# Altium project Muhtas_3.PrjPcb
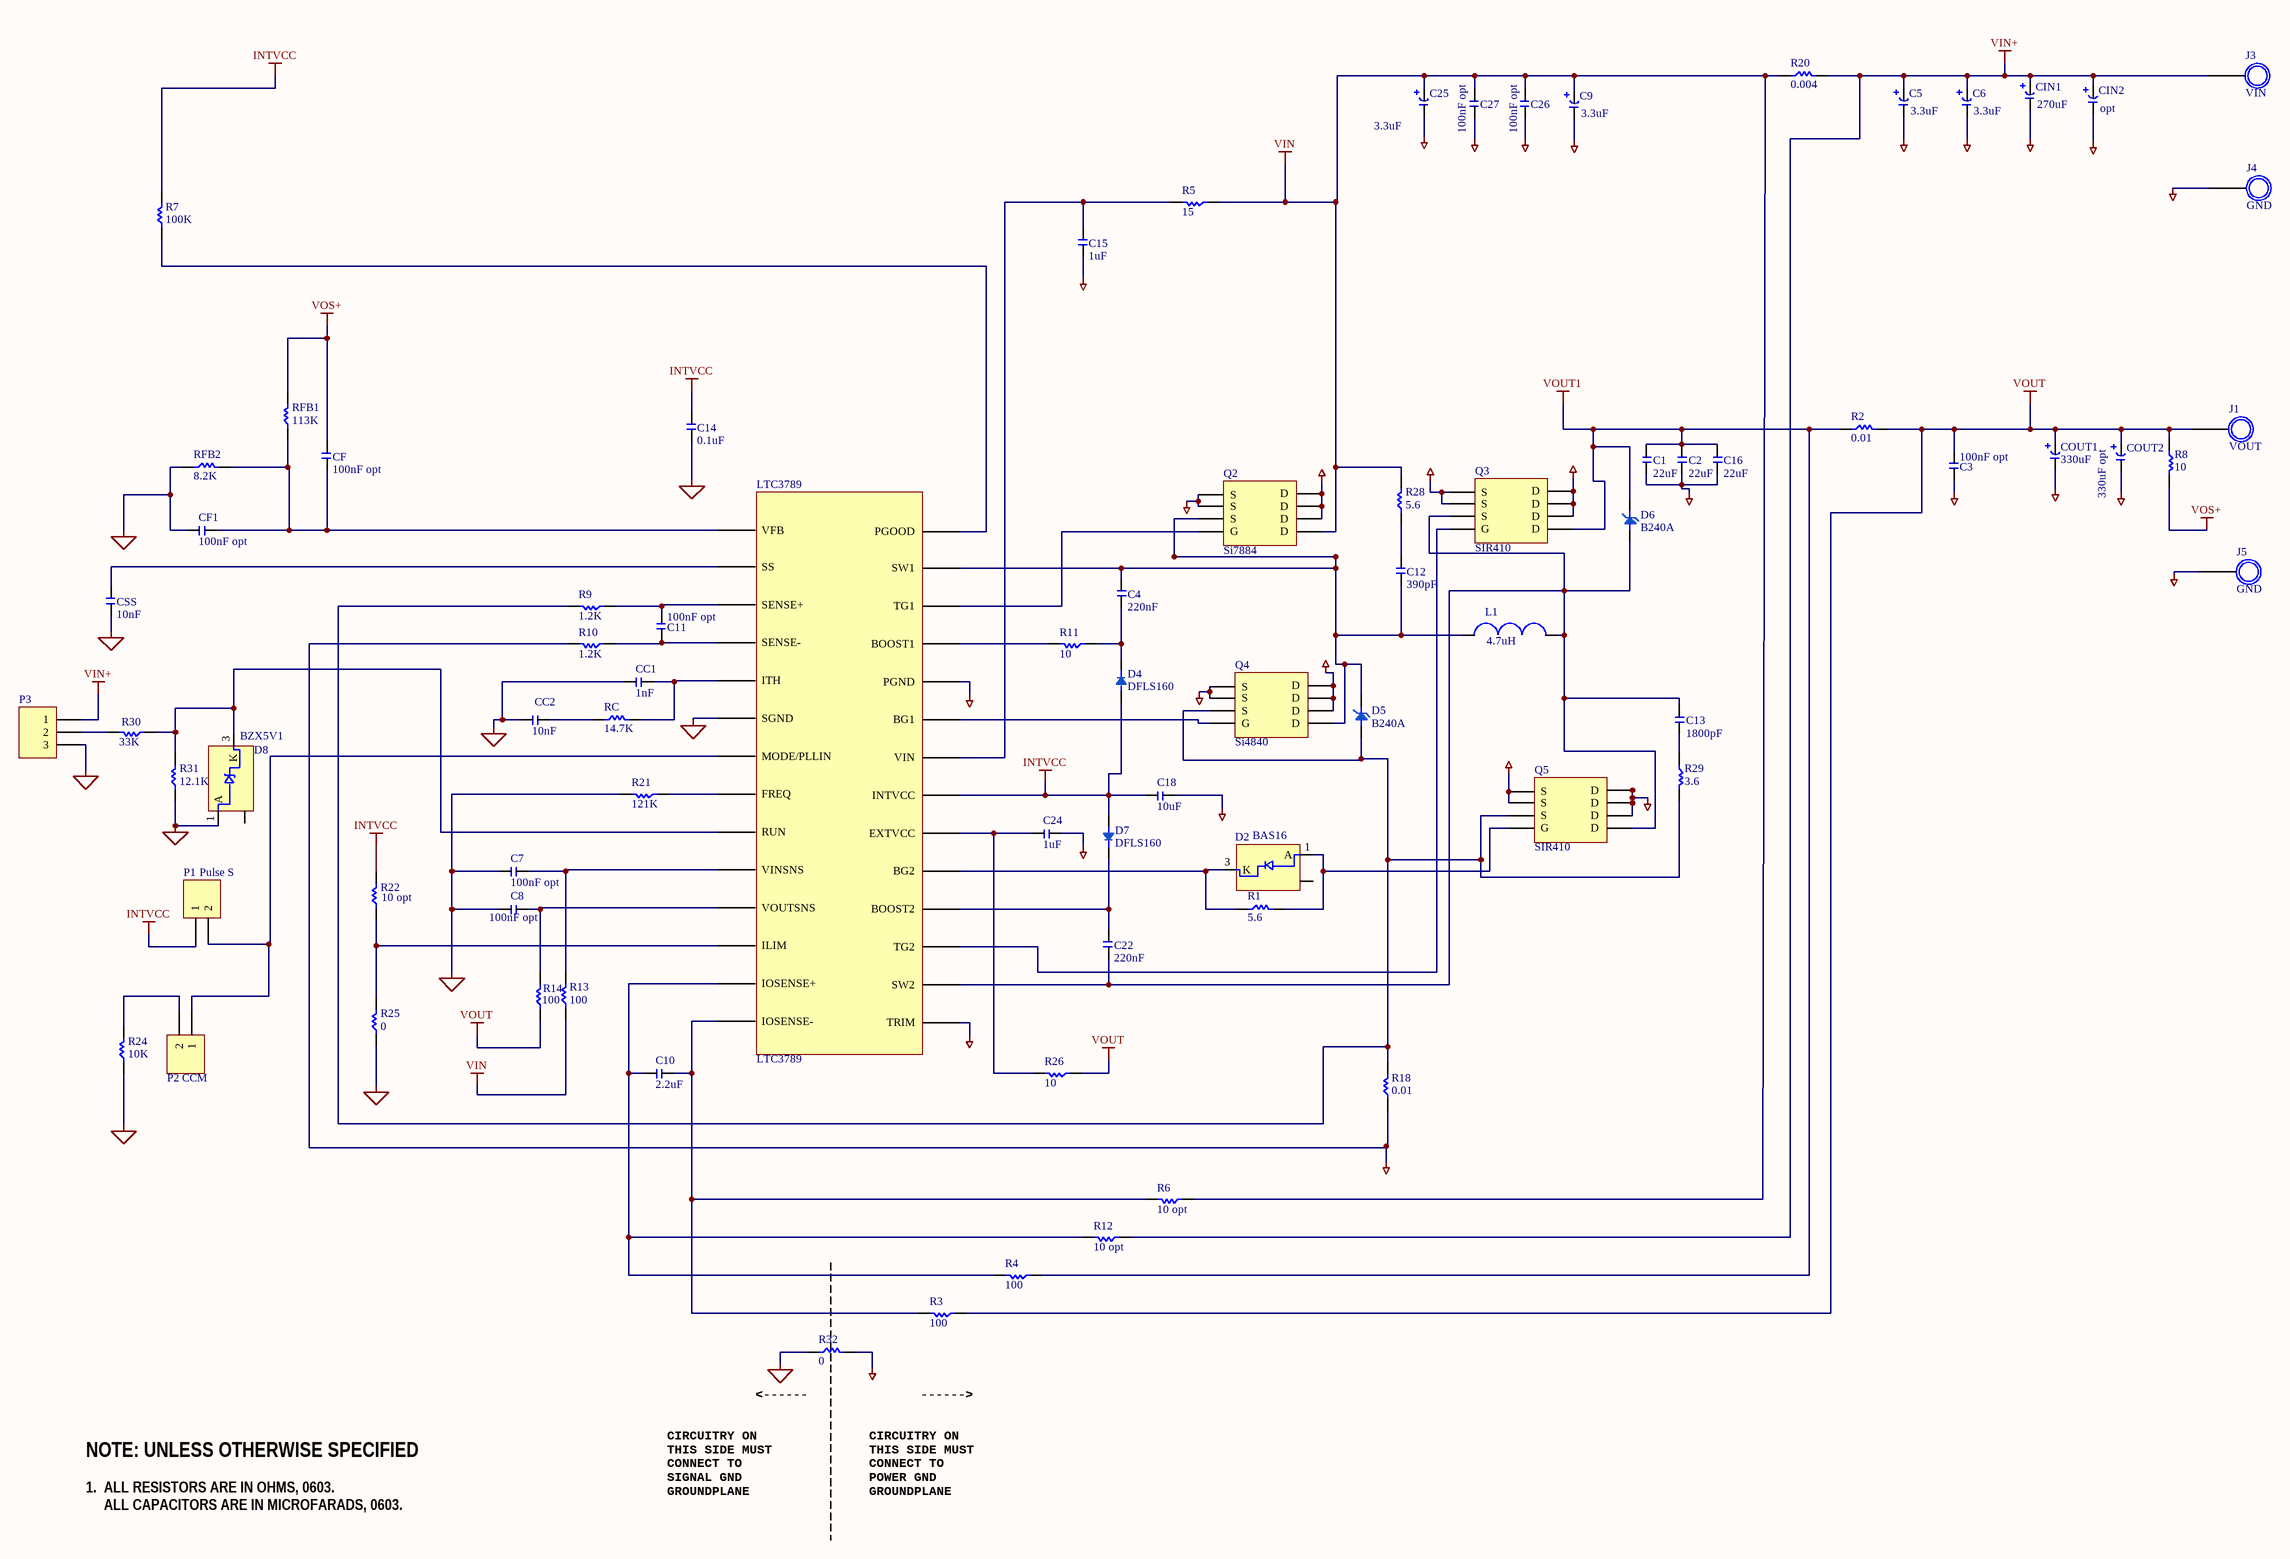
[diagram p0: muhtas3.SchDoc]
1 sheet, 79 parts. Net scope: global (net labels, ports and power ports of the same name join across sheets).
Board files: PCB4.PcbDoc, M_Tas3.PcbDoc

## Sheet muhtas3.SchDoc
size A2

### Parts
C1  22uF  [CAPC3216X190N(1206)]
C2  22uF  [CAPC3216X190N(1206)]
C3  100nF opt  [CAPC3216X190N(1206)]
C4  220nF  [CAPC2012X14N(0805)]
C5  3.3uF  [RAD5X10X16]
C6  3.3uF  [RAD5X10X16]
C7  100nF opt  [CAPC3216X190N(1206)]
C8  100nF opt  [CAPC3216X190N(1206)]
C9  3.3uF  [RAD5X10X16]
C10  2.2uF  [CAPC3216X190N(1206)]
C11  100nF opt  [CAPC3216X190N(1206)]
C12  390pF  [2.54X5.5MM]
C13  1800pF  [CAPC3216X190N(1206)]
C14  0.1uF  [CAPC3216X190N(1206)]
C15  1uF  [CAPC3216X190N(1206)]
C16  22uF  [CAPC3216X190N(1206)]
C18  10uF  [CAPC2012X14N(0805)]
C22  220nF  [CAPC2012X14N(0805)]
C24  1uF  [CAPC2012X14N(0805)]
C25  3.3uF  [RAD5X10X16]
C26  100nF opt  [CAPC3216X190N(1206)]
C27  100nF opt  [CAPC3216X190N(1206)]
CC1  1nF  [CAPC3216X190N(1206)]
CC2  10nF  [CAPC3216X190N(1206)]
CF  100nF opt  [CAPC3216X190N(1206)]
CF1  100nF opt  [CAPC3216X190N(1206)]
CIN1  270uF  [RAD5X10X16]
CIN2  opt  [RAD5X10X16]
COUT1  330uF  [OSCON]
COUT2  330uF opt  [OSCON]
CSS  10nF  [CAPC3216X190N(1206)]
D2  BAS16  [BZX5V1/SOT23]
D4  DFLS160  [DFLS160]
D5  B240A  [B240A]
D6  B240A  [B240A]
D7  DFLS160  [DFLS160]
D8  BZX5V1  [BZX5V1/SOT23]
J1  VOUT  [I/O]
J3  VIN  [I/O]
J4  GND  [I/O]
J5  GND  [I/O]
L1  4.7uH  [4.7UH]
LTC3789  LTC3789  [LTC3789]
P1  Header 2  [HDR1X2]  (value not drawn)
P2  Header 2  [HDR1X2]  (value not drawn)
P3  Header 3  [HDR1X3]  (value not drawn)
Q2  Si7884  [MOSFET]
Q3  SIR410  [MOSFET]
Q4  Si4840  [SOIC-8-SI4840]
Q5  SIR410  [MOSFET]
R1  5.6  [RESC2013X70N(0805)]
R2  0.01  [SUSUMU]
R3  100  [RESC3216X84N(1206)]
R4  100  [RESC3216X84N(1206)]
R5  15  [RESC3216X84N(1206)]
R6  10 opt  [RESC3216X84N(1206)]
R7  100K  [RESC3216X84N(1206)]
R8  10  [RESC3216X84N(1206)]
R9  1.2K  [AXIAL0.4]
R10  1.2K  [AXIAL0.4]
R11  10  [RESC3216X84N(1206)]
R12  10 opt  [RESC3216X84N(1206)]
R13  100  [RESC3216X84N(1206)]
R14  100  [RESC3216X84N(1206)]
R18  0.01  [SUSUMU]
R20  0.004  [SUSUMU]
R21  121K  [AXIAL0.4]
R22  10 opt  [RESC3216X84N(1206)]
R24  10K  [RESC3216X84N(1206)]
R25  0  [RESC2013X70N(0805)]
R26  10  [RESC3216X84N(1206)]
R28  5.6  [RESC2013X70N(0805)]
R29  3.6  [RESC3216X84N(1206)]
R30  33K  [RESC3216X84N(1206)]
R31  12.1K  [RESC2013X70N(0805)]
R32  0  [RESC2013X70N(0805)]
RC  14.7K  [RESC2013X70N(0805)]
RFB1  113K  [AXIAL0.4]
RFB2  8.2K  [RESC2013X70N(0805)]

### Nets
GND: C1.1 C2.1 C3.2 C5.2(K) C6.2(K) C9.2(K) C15.2 C16.1 C18.2 C24.2 C25.2(K) C26.2 C27.2 CIN1.2(K) CIN2.2(K) COUT1.2(K) COUT2.2(K) J4.1 J5.1 LTC3789.15(TRIM) LTC3789.24(PGND) Q2.1(S) Q2.2(S) Q2.6(D) Q2.7(D) Q2.8(D) Q3.1(S) Q3.2(S) Q3.6(D) Q3.7(D) Q3.8(D) Q4.1(S) Q4.2(S) Q4.6(D) Q4.7(D) Q4.8(D) Q5.1(S) Q5.2(S) Q5.6(D) Q5.7(D) Q5.8(D) R10.1 R18.2 R32.1
GND_SIGNAL: C7.1 C8.1 C14.2 CC1.1 CC2.1 CF1.1 CSS.2 D8.1(A) LTC3789.6(SGND) P3.3 R21.1 R24.2 R25.2 R31.2 R32.2 RFB2.2
INTVCC: C14.1 C18.1 D4.2(A) D7.2(A) LTC3789.21(INTVCC) P1.1 R7.1 R22.1
VIN: C9.1(A) C25.1(A) C26.1 C27.1 Q2.5(D) R5.2 R6.2 R13.2 R20.2 R28.1
VIN+: C5.1(A) C6.1(A) CIN1.1(A) CIN2.1(A) J3.1 P3.1 R12.2 R20.1
VOS+: CF.1 R8.1 RFB1.1
VOUT: C3.1 COUT1.1(A) COUT2.1(A) J1.1 R2.1 R3.2 R8.2 R14.2 R26.2
VOUT1: C1.2 C2.2 C16.2 D6.1(K) Q3.5(D) R2.2 R4.2
NetC4_1: C4.1 D4.1(K) R11.2
NetC4_2: C4.2 C12.2 D5.1(K) L1.1 LTC3789.27(SW1) Q2.3(S) Q4.5(D)
NetC7_2: C7.2 LTC3789.10(VINSNS) R13.1
NetC8_2: C8.2 LTC3789.11(VOUTSNS) R14.1
NetC10_1: C10.1 LTC3789.13(IOSENSE+) R4.1 R12.1
NetC10_2: C10.2 LTC3789.14(IOSENSE-) R3.1 R6.1
NetC11_1: C11.1 LTC3789.3(SENSE+) R9.2
NetC11_2: C11.2 LTC3789.4(SENSE-) R10.2
NetC12_1: C12.1 R28.2
NetC13_1: C13.1 R29.2
NetC13_2: C13.2 C22.2 D6.2(A) L1.2 LTC3789.16(SW2) Q3.3(S) Q5.5(D)
NetC15_1: C15.1 LTC3789.22(VIN) R5.1
NetC22_1: C22.1 D7.1(K) LTC3789.18(BOOST2)
NetC24_1: C24.1 LTC3789.20(EXTVCC) R26.1
NetCC1_2: CC1.2 LTC3789.5(ITH) RC.1
NetCC2_2: CC2.2 RC.2
NetCF_2: CF.2 CF1.2 LTC3789.1(VFB) RFB1.2 RFB2.1
NetCSS_1: CSS.1 LTC3789.2(SS)
NetD2_1: D2.1(A) Q5.4(G) R1.1
NetD2_3: D2.3(K) LTC3789.19(BG2) R1.2
NetD5_2: D5.2(A) Q4.3(S) Q5.3(S) R9.1 R18.1 R29.1
NetD8_3: D8.3(K) LTC3789.9(RUN) R30.2 R31.1
NetLTC3789_7: LTC3789.7(MODE/PLLIN) P1.2 P2.1
NetLTC3789_8: LTC3789.8(FREQ) R21.2
NetLTC3789_12: LTC3789.12(ILIM) R22.2 R25.1
NetLTC3789_17: LTC3789.17(TG2) Q3.4(G)
NetLTC3789_23: LTC3789.23(BG1) Q4.4(G)
NetLTC3789_25: LTC3789.25(BOOST1) R11.1
NetLTC3789_26: LTC3789.26(TG1) Q2.4(G)
NetLTC3789_28: LTC3789.28(PGOOD) R7.2
NetP2_2: P2.2 R24.1
NetP3_2: P3.2 R30.1

Not connected (* = marked no-connect by the designer): D2 2(not_connected); D8 2(not_connected)

### Notes on the sheet
- Pulse S
- CCM
- (near R32) <------               ------>
- 1.  ALL RESISTORS ARE IN OHMS, 0603.
  ALL CAPACITORS ARE IN MICROFARADS, 0603.
- NOTE: UNLESS OTHERWISE SPECIFIED
- CIRCUITRY ON
  THIS SIDE MUST
  CONNECT TO
  SIGNAL GND
  GROUNDPLANE
- CIRCUITRY ON
  THIS SIDE MUST
  CONNECT TO
  POWER GND
  GROUNDPLANE
- Title
- Size:
- Date:
- File:
- A2
- Number:
- Time:
- Revision:
- Sheet
- of

### Library data of the parts
C1-C3 C7 C8 C10 C11 C13-C16 C26 C27 CC1 CC2 CF CF1 CSS = VJ1206G475KXQTW1BC: CAPACITOR CERAMIC, 4.7UF, 10V, X5R, 10%, 1206, FULL REEL; Product Range:VJ?W1BC Series; Capacitance:4.7 F; Capacitance Tolerance: 10%; Dielectric Characteristic:X5R; Voltage Rating:10V; Ceramic Capacitor Case:1206 [3216 Metric] ;RoHS Compliant: Yes; Manufacturer: Vishay Vitramon; Component: 43; Dielectric Material: Tantalum; Manufacturer Part Number: VJ1206G475KXQTW1BC; Supplier 1: Mouser; Supplier Part Number 1: 77-VJ1206G475KXQTBC; RoHS: Yes; Category: Ceramic Capacitors; Stock 1: 1681; Pricing 1: 1=0,44000, 50=0,37200, 100=0,30800, 500=0,29900, 1000=0,29900, 2000=0,26000 (USD); Mount: Surface Mount; Case/Package: 1206; Min Operating Temperature: -55°C; Max Operating Temperature: 85°C; Capacitance: 4.7uF; Tolerance: 10%; Voltage Rating (DC): 10V; Dielectric: X5R; Length: 3.2mm; Height: 1.9mm; Depth: 1.6mm; ComponentLink1URL: https://datasheet.ciiva.com/11487/vjw1bcbascomseries-11487630.pdf?src-supplier=Avnet; ComponentLink1Description: https://datasheet.ciiva.com/11487/vjw1bcbascomseries-11487630.pdf?src-supplier=Avnet; Number of Pins: 2; Case Code (Metric): 3216; Case Code (Imperial): 1206; Packaging: Tape and Reel; Package Quantity: 2000; Termination: SMD/SMT; Width: 1.6mm; Lead Free: Lead Free
C4 C18 C22 C24 = CAP CER 100NF: TDK - CGA3E2X7R1H104K080AA. - CERAMIC CAPACITOR, 0.1UF, 50V, X7R, 0603, FULL REEL; Component: 8; Value: 100nF; Tolerance: 10%; Manufacturer Part Number: CAP CER 100NF; Supplier 1: Mouser; Supplier Part Number 1: 810-CGA3E2X7R1H104K; Manufacturer: TDK; RoHS: Yes; Category: Ceramic Capacitors; Stock 1: 5553529; Pricing 1: 1=0,11000, 10=0,07900, 100=0,03500, 500=0,02500, 1000=0,01900, 4000=0,01300 (USD); Mount: Surface Mount; Case/Package: 0603; Min Operating Temperature: -55°C; Max Operating Temperature: 125°C; Capacitance: 100nF; Voltage Rating (DC): 50V; Dielectric: X7R; Length: 1.6mm; Height: 0.8mm; Depth: 0.8mm; ComponentLink1URL: https://datasheet.ciiva.com/24216/cga3e2x7r1h104k080aa-266291-24216208.pdf?src-supplier=Mouser; ComponentLink1Description: https://datasheet.ciiva.com/24216/cga3e2x7r1h104k080aa-266291-24216208.pdf?src-supplier=Mouser; ComponentLink2URL: https://datasheet.ciiva.com/15192/getdatasheetpartid-715867-15192412.pdf?src-supplier=Verical; ComponentLink2Description: https://datasheet.ciiva.com/15192/getdatasheetpartid-715867-15192412.pdf?src-supplier=Verical; ComponentLink3URL: https://datasheet.ciiva.com/16500/mlccspec-automotive-general-midvoltage-en-16500693.pdf?src-supplier=Future+Electronics; ComponentLink3Description: https://datasheet.ciiva.com/16500/mlccspec-automotive-general-midvoltage-en-16500693.pdf?src-supplier=Future+Electronics; ComponentLink4URL: https://datasheet.ciiva.com/22725/1735392-22725642.pdf?src-supplier=Element14; ComponentLink4Description: https://datasheet.ciiva.com/22725/1735392-22725642.pdf?src-supplier=Element14; Case Code (Metric): 1608; Case Code (Imperial): 0603; Packaging: Tape and Reel; Voltage Rating: 50V; Package Quantity: 1; Termination: SMD/SMT; Voltage: 50V; Width: 0.8mm; Thickness: 0.035inch; Radiation Hardening: No; REACH SVHC: No SVHC; Lead Free: Lead Free; ComponentLink5URL: https://datasheet.ciiva.com/23803/1936565-23803084.pdf?src-supplier=Newark; ComponentLink5Description: https://datasheet.ciiva.com/23803/1936565-23803084.pdf?src-supplier=Newark; ComponentLink6URL: https://datasheet.ciiva.com/46385/1735392-46385708.pdf?src-supplier=Element14; ComponentLink6Description: https://datasheet.ciiva.com/46385/1735392-46385708.pdf?src-supplier=Element14; ComponentLink7URL: http://www.mouser.com/ds/2/212/KEM_C1012_X7R_OPENMODE_SMD-1103265.pdf?src-supplier=Mouser; ComponentLink7Description: http://www.mouser.com/ds/2/212/KEM_C1012_X7R_OPENMODE_SMD-1103265.pdf?src-supplier=Mouser; ComponentLink8URL: https://search.kemet.com/component-edge/download/datasheet/C0805F104K4RACTU.pdf?src-supplier=Digi-Key; Weight: 7.1E-05oz; Composition: Ceramic; Ratings: AEC-Q200; Features: Soft Termination
C5 C6 C9 C25 CIN1 CIN2 = CAP EL 470UF: ALUMINUM ELECTROLYTIC CAPACITOR 100UF, 63V, 20%, RADIAL, FULL REEL; Product Range:VR Series; Capacitance:100 F; Capacitance Tolerance: 20%; Voltage Rating:63V; Diameter:10mm; Capacitor Terminals:Radial Leaded; Packaging:Tape & Reel ;RoHS Compliant: Yes; Manufacturer: Nichicon; Component: 18; Dissipation Factor: 0.1%; Life (Hours): 2000Hour; Ripple Current: 300mA; Leakage Current: 189uA; Lead Diameter: 0.6mm; Manufacturer Part Number: CAP EL 470UF; Supplier 1: Arrow; Supplier Part Number 1: UVR1J101MPD1TD; RoHS: Yes; Category: Aluminum Electrolytic Capacitors; Stock 1: 105; Pricing 1: 1=0,21830, 10=0,14660, 25=0,05930, 100=0,05410, 2000=0,07080, 6000=0,06440 (USD); Mount: Through Hole,PCB; Case/Package: Radial; Min Operating Temperature: -40°C; Max Operating Temperature: 85°C; Capacitance: 100uF; Tolerance: 20%; Voltage Rating (DC): 63V; Length: 12.5mm; Height: 12.5mm; ComponentLink1URL: https://datasheet.ciiva.com/11685/e-vr-11685845.pdf?src-supplier=Avnet; ComponentLink1Description: https://datasheet.ciiva.com/11685/e-vr-11685845.pdf?src-supplier=Avnet; ComponentLink2URL: https://datasheet.ciiva.com/103/e-vr-103352.pdf?src-supplier=Digi-Key; ComponentLink2Description: https://datasheet.ciiva.com/103/e-vr-103352.pdf?src-supplier=Digi-Key; ComponentLink3URL: https://datasheet.ciiva.com/14603/70187464-14603353.pdf?src-supplier=Allied+Electronics; ComponentLink3Description: https://datasheet.ciiva.com/14603/70187464-14603353.pdf?src-supplier=Allied+Electronics; ComponentLink4URL: https://datasheet.ciiva.com/16392/e-vr-16392921.pdf?src-supplier=Future+Electronics; ComponentLink4Description: https://datasheet.ciiva.com/16392/e-vr-16392921.pdf?src-supplier=Future+Electronics; Number of Pins: 2; Packaging: Tape and Reel; Voltage Rating: 63V; Package Quantity: 500; Termination: Radial; Voltage: 63V; Diameter: 10mm; Height - Seated (Max): 0.492inch; Lead Pitch: 5mm; Radiation Hardening: No; REACH SVHC: No SVHC; ComponentLink5URL: https://datasheet.ciiva.com/46381/1758668-46381770.pdf?src-supplier=Element14; ComponentLink5Description: https://datasheet.ciiva.com/46381/1758668-46381770.pdf?src-supplier=Element14; ComponentLink6URL: https://datasheet.ciiva.com/17354/e-vr-17354940.pdf?src-supplier=Avnet+Europe; ComponentLink6Description: https://datasheet.ciiva.com/17354/e-vr-17354940.pdf?src-supplier=Avnet+Europe; ComponentLink7URL: https://datasheet.ciiva.com/7907/e-vr-7907502.pdf?src-supplier=Element14; ComponentLink7Description: https://datasheet.ciiva.com/7907/e-vr-7907502.pdf?src-supplier=Element14
C12 = CAP CER DISC 220PF: KEMET 220pF Multilayer Ceramic Capacitor (MLCC) 500 V dc 10% X7R dielectric C SMT max op. temp. +125C; Component: 2; Voltage Rating (DC): 500V; Dissipation Factor: 2.5%; Manufacturer Part Number: CAP CER DISC 220PF; Value: 220pF; Supplier 1: Mouser; Supplier Part Number 1: 80-C0805C221KCR; Manufacturer: KEMET; RoHS: Yes; Category: Ceramic Capacitors; Stock 1: 17842; Pricing 1: 1=0,37000, 10=0,21600, 100=0,15700, 500=0,13900, 1000=0,11800, 2500=0,09500 (USD); Mount: Surface Mount,PCB; Case/Package: 0805; Dielectric Material: Ceramic; Min Operating Temperature: -55°C; Max Operating Temperature: 125°C; Capacitance: 220pF; Tolerance: 10%; Dielectric: X7R; Length: 2mm; Height: 1.25mm; Depth: 1.2mm; ComponentLink1URL: https://datasheet.ciiva.com/14606/70096142-14606492.pdf?src-supplier=Allied+Electronics; ComponentLink1Description: https://datasheet.ciiva.com/14606/70096142-14606492.pdf?src-supplier=Allied+Electronics; Number of Pins: 2; Case Code (Metric): 2012; Case Code (Imperial): 0805; Packaging: Tape and Reel; Voltage Rating: 500V; Package Quantity: 1; Termination: SMD/SMT; Voltage: 500V; Width: 0.049inch; Thickness: 0.055inch
COUT1 COUT2 = 16SEPC180MX: CAP ALUM POLY 180UF 20% 16V T/H; Manufacturer: Panasonic; Component: 58; Dissipation Factor: 10%; Life (Hours): 5000Hour; Ripple Current: 5A; Leakage Current: 576uA; Polarity: Polar; ESR (Equivalent Series Resistance): 10mR; Lead Diameter: 0.6mm; Manufacturer Part Number: 16SEPC180MX; Supplier 1: Digi-Key; Supplier Part Number 1: P16295-ND; RoHS: Yes; Category: Polymer Capacitors; Stock 1: 64; Pricing 1: 1=1,03000, 10=0,78500, 50=0,65180, 100=0,56130, 500=0,43452, 1000=0,37417, 2500=0,35003, 5000=0,33193 (USD); Mount: Through Hole; Case/Package: Radial; Min Operating Temperature: -55°C; Max Operating Temperature: 105°C; Capacitance: 180uF; Tolerance: 20%; Voltage Rating (DC): 16V; Length: 9mm; Height: 9mm; ComponentLink1URL: https://datasheet.ciiva.com/25746/1734355-25746218.pdf?src-supplier=Farnell; ComponentLink1Description: https://datasheet.ciiva.com/25746/1734355-25746218.pdf?src-supplier=Farnell; ComponentLink2URL: https://datasheet.ciiva.com/24068/sepc-os-262388-24068492.pdf?src-supplier=Mouser; ComponentLink2Description: https://datasheet.ciiva.com/24068/sepc-os-262388-24068492.pdf?src-supplier=Mouser; ComponentLink3URL: https://datasheet.ciiva.com/22746/1734355-22746349.pdf?src-supplier=Element14; ComponentLink3Description: https://datasheet.ciiva.com/22746/1734355-22746349.pdf?src-supplier=Element14; Number of Pins: 9; Packaging: Bulk; Voltage Rating: 16V; Package Quantity: 200; Termination: Radial; Voltage: 16V; Diameter: 8mm; Height - Seated (Max): 0.354inch; Lead Pitch: 3.5mm; REACH SVHC: No SVHC
D2 = SIR410DP-T1-GE3: MOSFET 20V 35A 36W; Manufacturer: Vishay Siliconix; Component: 8; Number of Contacts: 0; Element Configuration: Single; Power Dissipation: 4.2W; Rds On Max: 4.8mR; Input Capacitance: 1.6nF; Rise Time: 15ns; Drain to Source Resistance: 5mR; Turn-Off Delay Time: 30ns; Turn-On Delay Time: 25ns; Threshold Voltage: 1.2V; Number of Channels: 1; Manufacturer Part Number: SIR410DP-T1-GE3; Supplier 1: Digi-Key; Supplier Part Number 1: SIR410DP-T1-GE3CT-ND; RoHS: Yes; Category: MOSFETs; Stock 1: 7964; Pricing 1: 1=1,02000, 10=0,91500, 25=0,86800, 100=0,65100, 500=0,55180, 1000=0,44950 (USD); Mount: Surface Mount; Number of Pins: 8; Weight: 0.01787oz; Min Operating Temperature: -55°C; Max Operating Temperature: 150°C; Packaging: Tape and Reel; Max Power Dissipation: 36W; Package Quantity: 1; Length: 4.9mm; Height: 1.04mm; Width: 5.89mm; Radiation Hardening: No; Lead Free: Lead Free; REACH SVHC: Unknown; ComponentLink1URL: https://datasheet.ciiva.com/6376/sir410d-6376914.pdf?src-supplier=Digi-Key; ComponentLink1Description: https://datasheet.ciiva.com/6376/sir410d-6376914.pdf?src-supplier=Digi-Key; ComponentLink2URL: https://datasheet.ciiva.com/4438/sir410d-280000-4438492.pdf?src-supplier=Mouser; ComponentLink2Description: https://datasheet.ciiva.com/4438/sir410d-280000-4438492.pdf?src-supplier=Mouser; Number of Rows: 0; Number of Positions: 0; Number of Elements: 0; Number of Unidirectional Channels: 0; Drain to Source Voltage (Vdss): 20V; Continuous Drain Current (ID): 35A; Drain to Source Breakdown Voltage: 20V; Gate to Source Voltage (Vgs): 20V; Fall Time: 15ns
D4 D7 = DFLS160Q-7: DIODE SCHOTTKY 60V 1A POWERDI123; Manufacturer: Diodes; Component: 11; Number of Contacts: 0; Element Configuration: Single; Forward Voltage: 500mV; Average Rectified Current: 01:00:00; Max Forward Surge Current (Ifsm): 50A; Max Reverse Current: 100uA; Manufacturer Part Number: DFLS160Q-7; Supplier 1: Digi-Key; Supplier Part Number 1: DFLS160Q-7DICT-ND; RoHS: Yes; Category: Rectifier Diodes; Stock 1: 17360; Pricing 1: 1=0,66000, 10=0,58300, 100=0,39770, 500=0,33230, 1000=0,28280 (USD); Mount: Surface Mount; Number of Pins: 123; Min Operating Temperature: -65°C; Max Operating Temperature: 150°C; Packaging: Tape and Reel; Package Quantity: 3000; ComponentLink1URL: http://www.mouser.com/ds/2/115/DFLS160Q-335693.pdf?src-supplier=Mouser; ComponentLink1Description: http://www.mouser.com/ds/2/115/DFLS160Q-335693.pdf?src-supplier=Mouser; ComponentLink2URL: http://diodes.com/datasheets/DFLS160Q.pdf?src-supplier=Avnet; ComponentLink2Description: http://diodes.com/datasheets/DFLS160Q.pdf?src-supplier=Avnet; ComponentLink3URL: https://www.diodes.com/assets/Datasheets/DFLS160Q.pdf?src-supplier=Digi-Key; ComponentLink3Description: https://www.diodes.com/assets/Datasheets/DFLS160Q.pdf?src-supplier=Digi-Key; Number of Rows: 0; Number of Positions: 0; Number of Elements: 0; Number of Unidirectional Channels: 0; Max Repetitive Reverse Voltage (Vrrm): 60V; Max Reverse Voltage (DC): 60V; Forward Current: 01:00:00
D5 D6 = B240-13-F: DIODES INC. - B240-13-F - Schottky Rectifier, 40 V, 2 A, Single, DO-214AA (SMB), 2 Pins, 500 mV; Component: 12; Voltage Rating (DC): 40V; Capacitance: 200pF; Current Rating: 2A; Number of Contacts: 0; Peak Non-Repetitive Surge Current: 50A; Forward Voltage: 500mV; Average Rectified Current: 02:00:00; Polarity: Standard; Max Reverse Current: 500uA; Manufacturer Part Number: B240-13-F; Supplier 1: Digi-Key; Supplier Part Number 1: B240-FDICT-ND; Manufacturer: Diodes; RoHS: Yes; Category: Schottky Diodes; Stock 1: 76580; Pricing 1: 1=0,41000, 10=0,30800, 100=0,14650, 500=0,12978, 1000=0,10100 (USD); Mount: Surface Mount; Case/Package: SMB; Number of Pins: 2; Weight: 0.00328oz; Contact Plating: Tin,Matte; Min Operating Temperature: -65°C; Max Operating Temperature: 150°C; Packaging: Tape and Reel; Termination: SMD/SMT; Package Quantity: 3000; Length: 4.57mm; Height: 2.62mm; Width: 3.94mm; Radiation Hardening: No; Lead Free: Lead Free; REACH SVHC: No SVHC; ComponentLink1URL: https://datasheet.ciiva.com/913/ds13004-913158.pdf?src-supplier=Digi-Key; ComponentLink1Description: https://datasheet.ciiva.com/913/ds13004-913158.pdf?src-supplier=Digi-Key; ComponentLink2URL: https://datasheet.ciiva.com/16201/ds13004-16201032.pdf?src-supplier=Future+Electronics; ComponentLink2Description: https://datasheet.ciiva.com/16201/ds13004-16201032.pdf?src-supplier=Future+Electronics; ComponentLink3URL: https://datasheet.ciiva.com/15144/getdatasheetpartid-91432-15144684.pdf?src-supplier=Verical; ComponentLink3Description: https://datasheet.ciiva.com/15144/getdatasheetpartid-91432-15144684.pdf?src-supplier=Verical; Number of Rows: 0; Number of Positions: 0; Element Configuration: Single; Number of Elements: 0; Number of Unidirectional Channels: 0; Max Repetitive Reverse Voltage (Vrrm): 40V; Max Reverse Voltage (DC): 40V; Forward Current: 02:00:00; Max Forward Surge Current (Ifsm): 50A; Output Current: 02:00:00; Current: 2A; Voltage: 40V
D8 = BZX84B5V1LT1G: Diode Zener Single 5.1V 2% 300mW 3-Pin SOT-23 T/R; Manufacturer: ON Semiconductor; Component: 9; Max Power Dissipation: 225mW; Number of Contacts: 0; Max Reverse Leakage Current: 2uA; Test Current: 5mA; ESD Protection: Yes; Forward Voltage: 900mV; Impedance: 60R; Material: Plastic; Zener Current: 10mA; Manufacturer Part Number: BZX84B5V1LT1G; Supplier 1: Digi-Key; Supplier Part Number 1: BZX84B5V1LT1GOSCT-ND; RoHS: Yes; Category: Zener Diodes; Stock 1: 57037; Pricing 1: 1=0,17000, 10=0,14600, 100=0,05620, 500=0,04680, 1000=0,02750 (USD); Case/Package: SOT-23-3; Number of Pins: 3; Contact Plating: Tin,Matte; Min Operating Temperature: -65°C; Max Operating Temperature: 150°C; Tolerance: 2%; Packaging: Tape and Reel; Power Rating: 225mW; Package Quantity: 3000; Voltage Rating (DC): 5.1V; Length: 2.9mm; Height: 0.94mm; Width: 1.3mm; Radiation Hardening: No; Lead Free: Lead Free; REACH SVHC: No SVHC; ComponentLink1URL: https://datasheet.ciiva.com/15142/getdatasheetpartid-38799-15142007.pdf?src-supplier=Verical; ComponentLink1Description: https://datasheet.ciiva.com/15142/getdatasheetpartid-38799-15142007.pdf?src-supplier=Verical; ComponentLink2URL: https://datasheet.ciiva.com/894/bzx84c2v4lt1-d-894869.pdf?src-supplier=Digi-Key; ComponentLink2Description: https://datasheet.ciiva.com/894/bzx84c2v4lt1-d-894869.pdf?src-supplier=Digi-Key; ComponentLink3URL: https://datasheet.ciiva.com/16542/bzx84c2v4lt1-d-16542005.pdf?src-supplier=Avnet+Asia; ComponentLink3Description: https://datasheet.ciiva.com/16542/bzx84c2v4lt1-d-16542005.pdf?src-supplier=Avnet+Asia; ComponentLink4URL: https://datasheet.ciiva.com/894/bzx84c2v4lt1-d-894870.pdf?src-supplier=Digi-Key; ComponentLink4Description: https://datasheet.ciiva.com/894/bzx84c2v4lt1-d-894870.pdf?src-supplier=Digi-Key; ComponentLink5URL: https://datasheet.ciiva.com/10637/bzx84c2v4lt1-d-10637782.pdf?src-supplier=Avnet; ComponentLink5Description: https://datasheet.ciiva.com/10637/bzx84c2v4lt1-d-10637782.pdf?src-supplier=Avnet; ComponentLink6URL: https://datasheet.ciiva.com/894/bzx84c2v4lt1-d-894871.pdf?src-supplier=Digi-Key; ComponentLink6Description: https://datasheet.ciiva.com/894/bzx84c2v4lt1-d-894871.pdf?src-supplier=Digi-Key; ComponentLink7URL: https://datasheet.ciiva.com/16419/bzx84c2v4lt1-d-16419770.pdf?src-supplier=Future+Electronics; ComponentLink7Description: https://datasheet.ciiva.com/16419/bzx84c2v4lt1-d-16419770.pdf?src-supplier=Future+Electronics; ComponentLink8URL: https://datasheet.ciiva.com/26092/bzx84c2v4lt1-d-26092127.pdf?src-supplier=Avnet+Europe; ComponentLink8Description: https://datasheet.ciiva.com/26092/bzx84c2v4lt1-d-26092127.pdf?src-supplier=Avnet+Europe; Working Voltage: 5.1V; Voltage Tolerance: 2%; Number of Rows: 0; Number of Positions: 0; Element Configuration: Single; Number of Elements: 0; Number of Unidirectional Channels: 0; Power Dissipation: 300mW; Halogen Free: Halogen Free; Zener Voltage: 5.1V; Max Reverse Current: 2uA
J1 J3-J5 = 78B03ST: SWITCH SLIDE DIP SPST 150MA 30V; Manufacturer: Grayhill; Component: 4; Number of Contacts: 0; Body Material: Thermoplastic; Mechanical Life: 2000Cycles; Actuator Type: Slide (Standard); Manufacturer Part Number: 78B03ST; Supplier 1: Digi-Key; Supplier Part Number 1: GH7182-ND; RoHS: Yes; Category: DIP Switches; Stock 1: 495; Pricing 1: 1=1,27000, 10=1,22500, 25=1,15160, 100=0,99470, 250=0,90652, 500=0,84280, 1000=0,78400, 2500=0,71050, 5000=0,66150 (USD); Mount: Through Hole,PCB; Contact Plating: Gold; Min Operating Temperature: -40°C; Max Operating Temperature: 85°C; Packaging: Rail/Tube; Termination: PC Pins; Voltage Rating (DC): 30V; ComponentLink1URL: https://datasheet.ciiva.com/16405/dip-series-78-spst-4pst-16405784.pdf?src-supplier=Future+Electronics; ComponentLink1Description: https://datasheet.ciiva.com/16405/dip-series-78-spst-4pst-16405784.pdf?src-supplier=Future+Electronics; ComponentLink2URL: https://datasheet.ciiva.com/16198/63dip-series-78-spst-4pst-16198539.pdf?src-supplier=Onlinecomponents.com; ComponentLink2Description: https://datasheet.ciiva.com/16198/63dip-series-78-spst-4pst-16198539.pdf?src-supplier=Onlinecomponents.com; ComponentLink3URL: https://datasheet.ciiva.com/2865/series78dip-2865725.pdf?src-supplier=Digi-Key; ComponentLink3Description: https://datasheet.ciiva.com/2865/series78dip-2865725.pdf?src-supplier=Digi-Key; ComponentLink4URL: https://datasheet.ciiva.com/15219/getdatasheetpartid-174628-15219357.pdf?src-supplier=Verical; ComponentLink4Description: https://datasheet.ciiva.com/15219/getdatasheetpartid-174628-15219357.pdf?src-supplier=Verical; ComponentLink5URL: https://datasheet.ciiva.com/14543/70216689-14543118.pdf?src-supplier=Allied+Electronics; ComponentLink5Description: https://datasheet.ciiva.com/14543/70216689-14543118.pdf?src-supplier=Allied+Electronics; Max Voltage Rating (DC): 30V; Current Rating: 150mA; Number of Rows: 0; Orientation: Straight; Number of Positions: 0; Number of Elements: 0; Number of Unidirectional Channels: 0; Contact Material: Copper Alloy,Brass,Gold; Throw Configuration: SPST; Electrical Life: 2000Cycles
L1 = IHLP2525CZER4R7M01: Inductor Power Shielded Wirewound 4.7uH 20% 100KHz 5.5A 40mOhm DCR 2525 T/R; Manufacturer: Vishay Dale; alan: 3; Core Material: Metal,Composite,Ferrite; DC Resistance (DCR): 40mR; Max DC Current: 10A; Self Resonant Frequency: 5MHz; Manufacturer Part Number: IHLP2525CZER4R7M01; Supplier 1: Digi-Key; Supplier Part Number 1: 541-1010-1-ND; RoHS: Yes; Stock 1: 66868; Pricing 1: 1=1,10000, 10=1,01700, 25=0,93920, 50=0,78260, 100=0,73560, 250=0,65732, 500=0,56340, 1000=0,50080 (USD); Category: Fixed Inductors; Mount: Surface Mount; Case/Package: 2525; Number of Pins: 2; Case Code (Metric): 6363; Case Code (Imperial): 2525; Contact Plating: Tin,Matte; Min Operating Temperature: -55°C; Max Operating Temperature: 125°C; Inductance Tolerance: 20%; Inductance: 4.7uH; Tolerance: 20%; Packaging: Tape and Reel; Current Rating: 5.5A; Shielding: Shielded; Package Quantity: 2000; Test Frequency: 100kHz; Saturation Current: 10A; Termination: SMD/SMT; RMS Current (Irms): 5.5A; Length: 7.24mm; Width: 0.255inch; Height: 3mm; Height - Seated (Max): 0.118inch; Depth: 6.72mm; Radiation Hardening: No; REACH SVHC: Unknown; Military Standard: Not; Lead Free: Lead Free; ComponentLink1URL: https://datasheet.ciiva.com/5706/1671361-5706705.pdf?src-supplier=Farnell; ComponentLink1Description: https://datasheet.ciiva.com/5706/1671361-5706705.pdf?src-supplier=Farnell; ComponentLink2URL: https://datasheet.ciiva.com/11798/0900766b8102c934-11798179.pdf?src-supplier=RSComponents; ComponentLink2Description: https://datasheet.ciiva.com/11798/0900766b8102c934-11798179.pdf?src-supplier=RSComponents; ComponentLink3URL: https://datasheet.ciiva.com/26793/ihlp2525czer4r7m01-26793547.pdf?src-supplier=IIIC; ComponentLink3Description: https://datasheet.ciiva.com/26793/ihlp2525czer4r7m01-26793547.pdf?src-supplier=IIIC; ComponentLink4URL: https://datasheet.ciiva.com/17247/lp25cz01-17247205.pdf?src-supplier=Avnet+Europe; ComponentLink4Description: https://datasheet.ciiva.com/17247/lp25cz01-17247205.pdf?src-supplier=Avnet+Europe; ComponentLink5URL: https://datasheet.ciiva.com/16335/lp25cz01-16335799.pdf?src-supplier=Future+Electronics; ComponentLink5Description: https://datasheet.ciiva.com/16335/lp25cz01-16335799.pdf?src-supplier=Future+Electronics; ComponentLink6URL: https://datasheet.ciiva.com/7290/ihlp25cz-7290185.pdf?src-supplier=Newark; ComponentLink6Description: https://datasheet.ciiva.com/7290/ihlp25cz-7290185.pdf?src-supplier=Newark; ComponentLink7URL: https://datasheet.ciiva.com/8495/lp25cz01-8495083.pdf?src-supplier=Avnet; ComponentLink7Description: https://datasheet.ciiva.com/8495/lp25cz01-8495083.pdf?src-supplier=Avnet; ComponentLink8URL: https://datasheet.ciiva.com/16940/70201586-16940508.pdf?src-supplier=Allied+Electronics; ComponentLink8Description: https://datasheet.ciiva.com/16940/70201586-16940508.pdf?src-supplier=Allied+Electronics; ComponentLink9URL: https://datasheet.ciiva.com/26821/getdatasheetpartid-74581-26821228.pdf?src-supplier=Verical; ComponentLink9Description: https://datasheet.ciiva.com/26821/getdatasheetpartid-74581-26821228.pdf?src-supplier=Verical
LTC3789 = LTC3789EGN#PBF: DC DC Cntrlr Dual-OUT Synchronous Boost/Buck Controller 4V to 38V Input Automotive 28-Pin SSOP N; Manufacturer: Analog Devices / Linear Technology; Component: 26; Output Current: 20A; Number of Outputs: 1; Switching Frequency: 710kHz; Output Type: Adjustable; Duty Cycle: 98%; Manufacturer Part Number: LTC3789EGN#PBF; Supplier 1: Digi-Key; Supplier Part Number 1: LTC3789EGN#PBF-ND; RoHS: Yes; Category: Voltage Regulators - Switching; Stock 1: 809; Pricing 1: 1=11,59000, 25=7,69960, 100=6,36480, 250=6,04656, 500=5,90954 (USD); Case/Package: SSOP; Number of Pins: 28; Min Operating Temperature: -40°C; Max Operating Temperature: 125°C; Package Quantity: 49; Packaging: Rail/Tube; REACH SVHC: No SVHC; ComponentLink1URL: https://datasheet.ciiva.com/14151/ltc3789-eng-ds-14151002.pdf?src-supplier=Distrelec; ComponentLink1Description: https://datasheet.ciiva.com/14151/ltc3789-eng-ds-14151002.pdf?src-supplier=Distrelec; ComponentLink2URL: https://datasheet.ciiva.com/15267/53789fb-15267774.pdf?src-supplier=Arrow+Europe; ComponentLink2Description: https://datasheet.ciiva.com/15267/53789fb-15267774.pdf?src-supplier=Arrow+Europe; ComponentLink3URL: https://datasheet.ciiva.com/26893/ltc3789egn-pbf-26893678.pdf?src-supplier=IIIC; ComponentLink3Description: https://datasheet.ciiva.com/26893/ltc3789egn-pbf-26893678.pdf?src-supplier=IIIC; ComponentLink4URL: https://datasheet.ciiva.com/6192/1865679-6192839.pdf?src-supplier=Farnell; ComponentLink4Description: https://datasheet.ciiva.com/6192/1865679-6192839.pdf?src-supplier=Farnell; ComponentLink5URL: https://datasheet.ciiva.com/7906/1865679-7906007.pdf?src-supplier=Element14; ComponentLink5Description: https://datasheet.ciiva.com/7906/1865679-7906007.pdf?src-supplier=Element14; ComponentLink6URL: https://datasheet.ciiva.com/7906/1511849-7906151.pdf?src-supplier=Element14; ComponentLink6Description: https://datasheet.ciiva.com/7906/1511849-7906151.pdf?src-supplier=Element14; ComponentLink7URL: https://datasheet.ciiva.com/2015/30095-2015247.pdf?src-supplier=Digi-Key; ComponentLink7Description: https://datasheet.ciiva.com/2015/30095-2015247.pdf?src-supplier=Digi-Key; Min Supply Voltage: 4V; Max Supply Voltage: 38V; Output Voltage: 38V; Max Frequency: 710kHz
P1 P2 = Header 2: Header, 2-Pin; LatestRevisionDate: 17-Jul-2002; LatestRevisionNote: Re-released for DXP Platform.; Publisher: Altium Limited
P3 = Header 3: Header, 3-Pin; LatestRevisionDate: 17-Jul-2002; LatestRevisionNote: Re-released for DXP Platform.; Publisher: Altium Limited
Q2 Q3 Q5 = SIR410DP-T1-GE3: MOSFET 20V 35A 36W; Manufacturer: Vishay Siliconix; Component: 27; Number of Channels: 1; Turn-On Delay Time: 25ns; Power Dissipation: 4.2W; Rise Time: 15ns; Element Configuration: Single; Turn-Off Delay Time: 30ns; Rds On Max: 4.8mR; Input Capacitance: 1.6nF; Drain to Source Resistance: 5mR; Threshold Voltage: 1.2V; Manufacturer Part Number: SIR410DP-T1-GE3; Supplier 1: Digi-Key; Supplier Part Number 1: SIR410DP-T1-GE3CT-ND; RoHS: Yes; Category: MOSFETs; Stock 1: 7964; Pricing 1: 1=1,02000, 10=0,91500, 25=0,86800, 100=0,65100, 500=0,55180, 1000=0,44950 (USD); Number of Pins: 8; Min Operating Temperature: -55°C; Max Operating Temperature: 150°C; Package Quantity: 1; Packaging: Tape and Reel; REACH SVHC: Unknown; ComponentLink1URL: https://datasheet.ciiva.com/6376/sir410d-6376914.pdf?src-supplier=Digi-Key; ComponentLink1Description: https://datasheet.ciiva.com/6376/sir410d-6376914.pdf?src-supplier=Digi-Key; ComponentLink2URL: https://datasheet.ciiva.com/4438/sir410d-280000-4438492.pdf?src-supplier=Mouser; ComponentLink2Description: https://datasheet.ciiva.com/4438/sir410d-280000-4438492.pdf?src-supplier=Mouser; Mount: Surface Mount; Weight: 0.01787oz; Max Power Dissipation: 36W; Length: 4.9mm; Height: 1.04mm; Width: 5.89mm; Radiation Hardening: No; Lead Free: Lead Free; Number of Elements: 1; Fall Time: 15ns; Continuous Drain Current (ID): 35A; Gate to Source Voltage (Vgs): 20V; Drain to Source Voltage (Vdss): 20V; Drain to Source Breakdown Voltage: 20V
Q4 = SI4840DY-T1-E3: MOSFET N-CH 40V 10A 8-SOIC; Manufacturer: Vishay Siliconix; Component: 30; Number of Channels: 1; Max Power Dissipation: 1.56W; Turn-On Delay Time: 15ns; Rise Time: 10ns; Fall Time: 20ns; Element Configuration: Single; Gate to Source Voltage (Vgs): 20V; Turn-Off Delay Time: 50ns; Rds On Max: 9mR; Manufacturer Part Number: SI4840DY-T1-E3; Supplier 1: Newark; Supplier Part Number 1: 35K3476; RoHS: Yes; Category: MOSFETs; Case/Package: SO; Number of Pins: 8; Min Operating Temperature: -55°C; Max Operating Temperature: 150°C; Package Quantity: 2500; Packaging: Tape and Reel; ComponentLink1URL: https://datasheet.ciiva.com/945/71188-945204.pdf?src-supplier=Digi-Key; ComponentLink1Description: https://datasheet.ciiva.com/945/71188-945204.pdf?src-supplier=Digi-Key; ComponentLink2URL: https://datasheet.ciiva.com/17084/si4840dy-t1-e3-17084039.pdf?src-supplier=Allied+Electronics; ComponentLink2Description: https://datasheet.ciiva.com/17084/si4840dy-t1-e3-17084039.pdf?src-supplier=Allied+Electronics; ComponentLink3URL: https://datasheet.ciiva.com/26790/si4840dy-t1-e3-26790652.pdf?src-supplier=IIIC; ComponentLink3Description: https://datasheet.ciiva.com/26790/si4840dy-t1-e3-26790652.pdf?src-supplier=IIIC; ComponentLink4URL: https://datasheet.ciiva.com/945/71188-945206.pdf?src-supplier=Digi-Key; ComponentLink4Description: https://datasheet.ciiva.com/945/71188-945206.pdf?src-supplier=Digi-Key; Mount: Surface Mount; Weight: 0.006596oz; Voltage Rating (DC): 40V; Length: 5mm; Height: 1.55mm; Width: 4mm; Lead Free: Lead Free; ComponentLink5URL: https://datasheet.ciiva.com/18403/70026069-18403703.pdf?src-supplier=Allied+Electronics; ComponentLink5Description: https://datasheet.ciiva.com/18403/70026069-18403703.pdf?src-supplier=Allied+Electronics; Number of Elements: 1; Power Dissipation: 1.56W; Continuous Drain Current (ID): 10A; Drain to Source Voltage (Vdss): 40V; Drain to Source Breakdown Voltage: 40V; Drain to Source Resistance: 9mR
R1 R28 R31 = RC2012J473AS: Res Thick Film 0805 47K Ohm 5% 1/8W ±100ppm/°C Molded SMD T/R; Manufacturer: Samsung; Component: 15; Resistance: 47kR; Power Rating: 125mW; Voltage Rating (DC): 150V; Number of Contacts: 0; Manufacturer Part Number: RC2012J473AS; Supplier 1: Avnet; Supplier Part Number 1: RC2012J473AS; RoHS: Yes; Category: Chip SMD Resistors; Mount: Surface Mount; Case/Package: 0805; Contact Plating: Tin; Min Operating Temperature: -55°C; Max Operating Temperature: 155°C; Tolerance: 5%; Temperature Coefficient: 100ppm/°C; Composition: Thick Film; Lead Free: Lead Free; ComponentLink1URL: https://sem.samsung.co.kr/servlet/DownloadServletWS?dir=/kr/product/&num=&fileName=Resistor_General.pdf&src-supplier=Avnet; ComponentLink1Description: https://sem.samsung.co.kr/servlet/DownloadServletWS?dir=/kr/product/&num=&fileName=Resistor_General.pdf&src-supplier=Avnet; ComponentLink2URL: https://sem.samsung.co.kr/servlet/DownloadServletWS?dir=/kr/product/&num=&fileName=Resistor_General.pdf&src-supplier=Avnet+Europe; ComponentLink2Description: https://sem.samsung.co.kr/servlet/DownloadServletWS?dir=/kr/product/&num=&fileName=Resistor_General.pdf&src-supplier=Avnet+Europe; Number of Rows: 0; Number of Positions: 0; Number of Elements: 0; Number of Unidirectional Channels: 0
R2 R18 R20 = RL1220S-R50-F: SUSUMU         RL1220S-R50-F             SMD Current Sense Resistor, 0.5 ohm, 0805 [2012 Metric], 250 mW,  1%, RL Series; Component: 26; Resistance: 500mR; Temperature Coefficient: 200ppm/°C; Max Power Dissipation: 333mW; Power Rating: 250mW; Voltage Rating (DC): 100V; Number of Contacts: 0; Manufacturer Part Number: RL1220S-R50-F; Supplier 1: Digi-Key; Supplier Part Number 1: RL12S.50FCT-ND; Manufacturer: Susumu; RoHS: Yes; Category: Chip SMD Resistors; Stock 1: 218491; Pricing 1: 1=0,29000, 10=0,24300, 25=0,17640, 50=0,12780, 100=0,09480, 250=0,07276, 500=0,05734, 1000=0,03969 (USD); Case/Package: 0805; Number of Pins: 2; Weight: 0.000194oz; Case Code (Imperial): 0805; Case Code (Metric): 2012; Min Operating Temperature: -55°C; Max Operating Temperature: 125°C; Tolerance: 1%; Packaging: Tape and Reel; Number of Terminations: 2; Termination: SMD/SMT; Package Quantity: 1; Length: 0.079inch; Height: 0.02inch; Width: 0.049inch; Lead Free: Lead Free; REACH SVHC: Unknown; ComponentLink1URL: https://datasheet.ciiva.com/2487/rl-data-sheet-2487714.pdf?src-supplier=Digi-Key; ComponentLink1Description: https://datasheet.ciiva.com/2487/rl-data-sheet-2487714.pdf?src-supplier=Digi-Key; ComponentLink2URL: https://datasheet.ciiva.com/2487/rl-data-sheet-2487715.pdf?src-supplier=Digi-Key; ComponentLink2Description: https://datasheet.ciiva.com/2487/rl-data-sheet-2487715.pdf?src-supplier=Digi-Key; ComponentLink3URL: https://datasheet.ciiva.com/2487/rl-data-sheet-2487716.pdf?src-supplier=Digi-Key; ComponentLink3Description: https://datasheet.ciiva.com/2487/rl-data-sheet-2487716.pdf?src-supplier=Digi-Key; ComponentLink4URL: https://datasheet.ciiva.com/12837/e-15-16-12837656.pdf?src-supplier=Mouser; ComponentLink4Description: https://datasheet.ciiva.com/12837/e-15-16-12837656.pdf?src-supplier=Mouser; ComponentLink5URL: https://datasheet.ciiva.com/7984/87305-7984266.pdf?src-supplier=Element14; ComponentLink5Description: https://datasheet.ciiva.com/7984/87305-7984266.pdf?src-supplier=Element14; Number of Rows: 0; Number of Positions: 0; Number of Elements: 0; Number of Unidirectional Channels: 0; Resistor Type: Thin Film
R3-R6 R8 R11-R14 R22 R24 R26 R29 R30 = RES  56K 1/4W: Resistor,Metal Glaze,56KOhms,200WV,5+/-% Tol,-200,200ppm-TC,1206-Case ;RoHS Compliant: Yes; Manufacturer: Vishay Dale; Component: 2; Value: 100K; Resistance: 56kR; Tolerance: 5%; Temperature Coefficient: 200ppm/°C; Max Power Dissipation: 250mW; Voltage Rating: 200V; Manufacturer Part Number: RES  56K 1/4W; Supplier 1: Mouser; Supplier Part Number 1: 71-CRCW1206J-56K-E3; RoHS: Yes; Category: Chip SMD Resistors; Stock 1: 9995; Pricing 1: 1=0,10000, 10=0,07300, 100=0,02900, 1000=0,01200, 5000=0,00800, 10000=0,00700 (USD); Case/Package: 1206; Number of Pins: 2; Weight: 0.000353oz; Case Code (Imperial): 1206; Case Code (Metric): 3216; Contact Plating: Tin; Min Operating Temperature: -55°C; Max Operating Temperature: 155°C; Packaging: Tape and Reel; Composition: Thick Film; Number of Terminations: 2; Features: Automotive AEC-Q200; Power Rating: 250mW; Package Quantity: 5000; Voltage Rating (DC): 200V; Military Standard: Not; Length: 3.2mm; Height: 0.55mm; Width: 0.063inch; Depth: 1.6mm; Radiation Hardening: No; Lead Free: Lead Free; REACH SVHC: Unknown; ComponentLink1URL: https://datasheet.ciiva.com/2496/dcrcwe3-2496448.pdf?src-supplier=Digi-Key; ComponentLink1Description: https://datasheet.ciiva.com/2496/dcrcwe3-2496448.pdf?src-supplier=Digi-Key; ComponentLink2URL: https://datasheet.ciiva.com/2496/dcrcwe3-2496449.pdf?src-supplier=Digi-Key; ComponentLink2Description: https://datasheet.ciiva.com/2496/dcrcwe3-2496449.pdf?src-supplier=Digi-Key; ComponentLink3URL: https://datasheet.ciiva.com/2496/dcrcwe3-2496450.pdf?src-supplier=Digi-Key; ComponentLink3Description: https://datasheet.ciiva.com/2496/dcrcwe3-2496450.pdf?src-supplier=Digi-Key; ComponentLink4URL: https://datasheet.ciiva.com/8999/dcrcwe3-8999045.pdf?src-supplier=Avnet; ComponentLink4Description: https://datasheet.ciiva.com/8999/dcrcwe3-8999045.pdf?src-supplier=Avnet; ComponentLink5URL: https://datasheet.ciiva.com/8999/dcrcwe3-8999051.pdf?src-supplier=Avnet; ComponentLink5Description: https://datasheet.ciiva.com/8999/dcrcwe3-8999051.pdf?src-supplier=Avnet; Working Voltage: 200V; Height - Seated (Max): 0.024inch
R7 = RES  56K 1/4W: Resistor,Metal Glaze,56KOhms,200WV,5+/-% Tol,-200,200ppm-TC,1206-Case ;RoHS Compliant: Yes; Manufacturer: Vishay Dale; Component: 2; Resistance: 56kR; Tolerance: 5%; Temperature Coefficient: 200ppm/°C; Max Power Dissipation: 250mW; Voltage Rating: 200V; Manufacturer Part Number: RES  56K 1/4W; Value: 100K; Supplier 1: Mouser; Supplier Part Number 1: 71-CRCW1206J-56K-E3; RoHS: Yes; Category: Chip SMD Resistors; Stock 1: 9995; Pricing 1: 1=0,10000, 10=0,07300, 100=0,02900, 1000=0,01200, 5000=0,00800, 10000=0,00700 (USD); Case/Package: 1206; Number of Pins: 2; Weight: 0.000353oz; Case Code (Imperial): 1206; Case Code (Metric): 3216; Contact Plating: Tin; Min Operating Temperature: -55°C; Max Operating Temperature: 155°C; Packaging: Tape and Reel; Composition: Thick Film; Number of Terminations: 2; Features: Automotive AEC-Q200; Power Rating: 250mW; Package Quantity: 5000; Voltage Rating (DC): 200V; Military Standard: Not; Length: 3.2mm; Height: 0.55mm; Width: 0.063inch; Depth: 1.6mm; Radiation Hardening: No; Lead Free: Lead Free; REACH SVHC: Unknown; ComponentLink1URL: https://datasheet.ciiva.com/2496/dcrcwe3-2496448.pdf?src-supplier=Digi-Key; ComponentLink1Description: https://datasheet.ciiva.com/2496/dcrcwe3-2496448.pdf?src-supplier=Digi-Key; ComponentLink2URL: https://datasheet.ciiva.com/2496/dcrcwe3-2496449.pdf?src-supplier=Digi-Key; ComponentLink2Description: https://datasheet.ciiva.com/2496/dcrcwe3-2496449.pdf?src-supplier=Digi-Key; ComponentLink3URL: https://datasheet.ciiva.com/2496/dcrcwe3-2496450.pdf?src-supplier=Digi-Key; ComponentLink3Description: https://datasheet.ciiva.com/2496/dcrcwe3-2496450.pdf?src-supplier=Digi-Key; ComponentLink4URL: https://datasheet.ciiva.com/8999/dcrcwe3-8999045.pdf?src-supplier=Avnet; ComponentLink4Description: https://datasheet.ciiva.com/8999/dcrcwe3-8999045.pdf?src-supplier=Avnet; ComponentLink5URL: https://datasheet.ciiva.com/8999/dcrcwe3-8999051.pdf?src-supplier=Avnet; ComponentLink5Description: https://datasheet.ciiva.com/8999/dcrcwe3-8999051.pdf?src-supplier=Avnet; Working Voltage: 200V; Height - Seated (Max): 0.024inch
R9 R10 R21 RFB1 = CRCW0805270RFKEA: Resistor; Thick Film; 270 Ohms; 0.125 W; 1%; SMT; 0805; TCR 37 ppm/DegC; Tape and Reel; Manufacturer: Vishay; Component: 30; Resistance: 270R; Temperature Coefficient: 100ppm/°C; Power Rating: 125mW; Voltage Rating: 150V; Number of Contacts: 0; Manufacturer Part Number: CRCW0805270RFKEA; Supplier 1: Digi-Key; Supplier Part Number 1: 541-270CCT-ND; RoHS: Yes; Category: Chip SMD Resistors; Stock 1: 8827; Pricing 1: 1=0,10000, 10=0,05700, 100=0,02310, 1000=0,01039, 2500=0,00902 (USD); Mount: Surface Mount; Case/Package: 0805; Weight: 0.000194oz; Case Code (Imperial): 0805; Case Code (Metric): 2012; Contact Plating: Tin; Min Operating Temperature: -55°C; Max Operating Temperature: 155°C; Tolerance: 1%; Packaging: Tape and Reel; Termination: SMD/SMT; Package Quantity: 5000; Voltage Rating (DC): 150V; Military Standard: Not; Length: 2mm; Height: 0.45mm; Width: 1.25mm; Depth: 1.25mm; Radiation Hardening: No; Lead Free: Lead Free; REACH SVHC: Unknown; ComponentLink1URL: https://datasheet.ciiva.com/11811/0900766b80d98b26-11811341.pdf?src-supplier=RSComponents; ComponentLink1Description: https://datasheet.ciiva.com/11811/0900766b80d98b26-11811341.pdf?src-supplier=RSComponents; ComponentLink2URL: https://datasheet.ciiva.com/5541/dcrcwe3-109170-5541253.pdf?src-supplier=Mouser; ComponentLink2Description: https://datasheet.ciiva.com/5541/dcrcwe3-109170-5541253.pdf?src-supplier=Mouser; ComponentLink3URL: https://datasheet.ciiva.com/16775/70201119-16775622.pdf?src-supplier=Allied+Electronics; ComponentLink3Description: https://datasheet.ciiva.com/16775/70201119-16775622.pdf?src-supplier=Allied+Electronics; ComponentLink4URL: https://datasheet.ciiva.com/8951/dcrcwe3-8951175.pdf?src-supplier=Avnet; ComponentLink4Description: https://datasheet.ciiva.com/8951/dcrcwe3-8951175.pdf?src-supplier=Avnet; ComponentLink5URL: https://datasheet.ciiva.com/8951/dcrcwe3-8951176.pdf?src-supplier=Avnet; ComponentLink5Description: https://datasheet.ciiva.com/8951/dcrcwe3-8951176.pdf?src-supplier=Avnet; ComponentLink6URL: https://datasheet.ciiva.com/17164/dcrcwe3-17164846.pdf?src-supplier=Avnet+Europe; ComponentLink6Description: https://datasheet.ciiva.com/17164/dcrcwe3-17164846.pdf?src-supplier=Avnet+Europe; ComponentLink7URL: https://datasheet.ciiva.com/26317/fld-crcw-e3-data-en-26317342.pdf?src-supplier=Distrelec; ComponentLink7Description: https://datasheet.ciiva.com/26317/fld-crcw-e3-data-en-26317342.pdf?src-supplier=Distrelec; Number of Rows: 0; Number of Positions: 0; Number of Elements: 0; Number of Unidirectional Channels: 0; Resistor Type: Thick Film
R25 R32 = RC2012J473AS: Res Thick Film 0805 47K Ohm 5% 1/8W ±100ppm/°C Molded SMD T/R; Manufacturer: Samsung; Component: 15; Resistance: 47kR; Power Rating: 125mW; Voltage Rating (DC): 150V; Manufacturer Part Number: RC2012J473AS; Supplier 1: Avnet; Supplier Part Number 1: RC2012J473AS; RoHS: Yes; Category: Chip SMD Resistors; Mount: Surface Mount; Case/Package: 0805; Contact Plating: Tin; Min Operating Temperature: -55°C; Max Operating Temperature: 155°C; Tolerance: 5%; Temperature Coefficient: 100ppm/°C; Composition: Thick Film; Lead Free: Lead Free; ComponentLink1URL: https://sem.samsung.co.kr/servlet/DownloadServletWS?dir=/kr/product/&num=&fileName=Resistor_General.pdf&src-supplier=Avnet; ComponentLink1Description: https://sem.samsung.co.kr/servlet/DownloadServletWS?dir=/kr/product/&num=&fileName=Resistor_General.pdf&src-supplier=Avnet; ComponentLink2URL: https://sem.samsung.co.kr/servlet/DownloadServletWS?dir=/kr/product/&num=&fileName=Resistor_General.pdf&src-supplier=Avnet+Europe; ComponentLink2Description: https://sem.samsung.co.kr/servlet/DownloadServletWS?dir=/kr/product/&num=&fileName=Resistor_General.pdf&src-supplier=Avnet+Europe; Number of Rows: 0; Number of Contacts: 0; Number of Positions: 0; Number of Elements: 0; Number of Unidirectional Channels: 0
RC RFB2 = ERJ-P06F25R5V: Res Thick Film 0805 25.5 Ohm 1% 1/4W 300ppm/C Molded SMD Punched Carrier T/R; Manufacturer: Panasonic; Component: 21; Resistance: 2mm; Tolerance: 0.6mm; Voltage Rating (DC): 2012; Resistance1: 25.5R; Temperature Coefficient1: 300ppm/°C; Power Rating1: 500mW; Manufacturer Part Number: ERJ-P06F25R5V; Supplier 1: Newark; Supplier Part Number 1: 85Y6938; RoHS: Yes; Category: Chip SMD Resistors; Stock 1: 2949; Pricing 1: 10=0,08600, 25=0,07900, 50=0,07100, 100=0,04800, 250=0,04000, 500=0,03200, 1000=0,02200 (USD); Mount: Surface Mount; Case/Package: 0805; Weight: -55°C; Case Code (Imperial): 155°C; Contact Plating: 1%; Min Operating Temperature: 400V; Packaging: https://datasheet.ciiva.com/24032/aoa0000ce4-64075-24032358.pdf?src-supplier=Mouser; Composition: https://datasheet.ciiva.com/24032/aoa0000ce4-64075-24032358.pdf?src-supplier=Mouser; Max Power Dissipation: https://datasheet.ciiva.com/22799/1801181-22799275.pdf?src-supplier=Farnell; Number of Terminations: https://datasheet.ciiva.com/22799/1801181-22799275.pdf?src-supplier=Farnell; Military Standard: 0805; Length: Tape and Reel; Height: 150V; Width: 5000; REACH SVHC: 1.2mm; ComponentLink7Description: No SVHC; Resistor Type: Thick Film